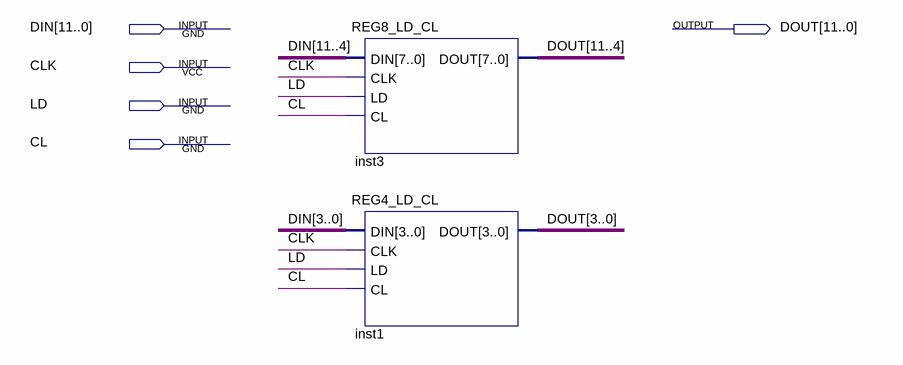
[diagram p0: schematic sheet]
// Quartus schematic REG12_LD_CL.bdf as structural Verilog: 2 symbols, 5 pins
module REG12_LD_CL (
  input  [11:0] DIN,
  input  CLK,
  input  LD,
  input  CL,
  output [11:0] DOUT
);

  REG8_LD_CL inst3 (.DIN(DIN[11:4]), .CLK(CLK), .LD(LD), .CL(CL), .DOUT(DOUT[11:4]));
  REG4_LD_CL inst1 (.DIN(DIN[3:0]), .CLK(CLK), .LD(LD), .CL(CL), .DOUT(DOUT[3:0]));
endmodule
